# EAGLE design arduino_uno_pcb _with_lcd (EAGLE 6.1)
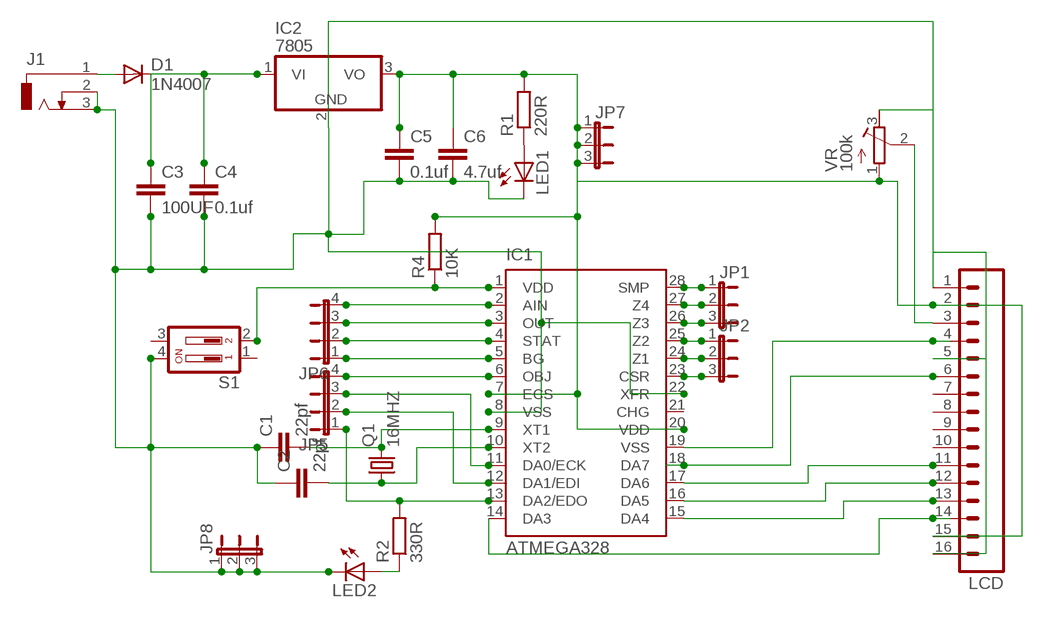
[diagram p0: schematic, sheet 1]

## Parts
C1  22pf  C2.5/2  [C2.5-2]
C2  22pf  C2.5/2  [C2.5-2]
C3  100UF  C2.5/2  [C2.5-2]
C4  0.1uf  C2.5/2  [C2.5-2]
C5  0.1uf  C2.5/2  [C2.5-2]
C6  4.7uf  C2.5/2  [C2.5-2]
D1  1N4007  1N4004  [DO41-10]
IC1  ATMEGA328  QT9701BD  [DIL28-3]
IC2  7805  786TV  [TO220V]
J1  DCJ0303  [DCJ0303]
JP1  JP2E  [JP2]
JP2  JP2E  [JP2]
JP5  JP4E  [JP4]
JP6  JP4E  [JP4]
JP7  JP2E  [JP2]
JP8  JP2E  [JP2]
LCD  M16  [16P]
LED1  LED3MM  [LED3MM]
LED2  LED3MM  [LED3MM]
Q1  16MHZ  CRYSTALHC49S  [HC49/S]
R1  220R  R-EU_0207/10  [0207/10]
R2  330R  R-EU_0207/10  [0207/10]
R4  10K  R-EU_0207/10  [0207/10]
S1  DP02  [DP-02]
VR  100k  R-TRIMM64P  [RTRIM64P]

## Nets
N$1: C1.2 IC1.9(XT1) Q1.2
N$2: C2.2 IC1.10(XT2) Q1.1
N$3: D1.A J1.1
N$4: C5.1 C6.1 IC1.7(ECS) IC1.20(VDD) IC2.3(VO) JP7.1 JP7.2 JP7.3 LCD.2 LCD.15 R1.2 R4.2 VR.1(E)
N$5: C1.1 C2.1 C3.2 C4.2 C5.2 C6.2 IC1.8(VSS) IC1.22(XFR) IC2.2(GND) J1.2 J1.3 JP8.1 JP8.2 JP8.3 LCD.1 LCD.5 LCD.16 LED1.K(C) LED2.K(C) S1.4 VR.3(A)
N$6: LED1.A R1.1
N$7: C3.1 C4.1 D1.C IC2.1(VI)
N$8: IC1.28(SMP) JP1.1
N$9: IC1.27(Z4) JP1.2
N$10: IC1.26(Z3) JP1.3
N$11: IC1.25(Z2) JP2.1
N$12: IC1.24(Z1) JP2.2
N$13: IC1.23(CSR) JP2.3
N$14: IC1.5(BG) JP6.1
N$15: IC1.2(AIN) JP6.4
N$16: IC1.3(OUT) JP6.3
N$17: IC1.4(STAT) JP6.2
N$18: IC1.6(OBJ) JP5.4
N$19: IC1.12(DA1/EDI) JP5.2
N$20: IC1.11(DA0/ECK) JP5.3
N$21: IC1.13(DA2/EDO) JP5.1 R2.2
N$22: LCD.3 VR.2(S)
N$23: IC1.19(VSS) LCD.4
N$24: IC1.18(DA7) LCD.6
N$25: IC1.17(DA6) LCD.11
N$26: IC1.16(DA5) LCD.12
N$27: IC1.15(DA4) LCD.13
N$29: IC1.14(DA3) LCD.14
N$31: IC1.1(VDD) R4.1 S1.2
N$32: LED2.A R2.1
Unconnected: IC1.21(CHG) LCD.7 LCD.8 LCD.9 LCD.10 S1.1 S1.3

## Library data of the parts
C1-C6 = capacitor-wima:C: CAPACITOR naming: grid - package width
D1 = diode:1N4004: DIODE general purpose rectifier, 1 A
IC1 = quantum-research-group:QT9701B: Charge-Transfer Capacitance Sensor IC Source: http://data.qprox.com/downloads/datasheets/qt9701b.pdf; OC_FARNELL: unknown; OC_NEWARK: unknown
IC2 = linear:78*: Positive VOLTAGE REGULATOR Source: http://cache.national.com/ds/LM/LM78L05.pdf http://www.fairchildsemi.com/ds/LM/LM7805.pdf
J1 = con-jack:DCJ0303: DC POWER JACK Source: DCJ0303.pdf; OC_FARNELL: unknown; OC_NEWARK: unknown
JP1 JP2 JP7 JP8 = jumper:JP2E: JUMPER
JP5 JP6 = jumper:JP4E: JUMPER
LCD = con-amp-quick:M16: AMP QUICK CONNECTOR; OC_FARNELL: unknown; OC_NEWARK: unknown
LED1 LED2 = led:LED: LED OSRAM: - CHIPLED LG R971, LG N971, LY N971, LG Q971, LY Q971, LO R971, LY R971 LH N974, LH R974 LS Q976, LO Q976, LY Q976 LO Q996 - Hyper CHIPLED LW Q18S LB Q993, LB Q99A, LB R99A - SideLED LS A670, LO A670, LY A670, LG A670, LP A670 LB A673, LV A673, LT A673, LW A673 LH A674 LY A675 LS A676, LA A676, LO A676, LY A676, LW A676 LS A679, LY A679, LG A679 - Hyper Micro SIDELED® LS Y876, LA Y876, LO Y876, LY Y876 LT Y87S - SmartLED LW L88C, LW L88S LB L89C, LB L89S, LG L890 LS L89K, LO L89K, LY L89K LS L896, LA L896, LO L896, LY L896 - TOPLED LS T670, LO T670, LY T670, LG T670, LP T670 LSG T670, LSP T670, LSY T670, LOP T670, LYG T670 LG T671, LOG T671, LSG T671 LB T673, LV T673, LT T673, LW T673 LH T674 LS T676, LA T676, LO T676, LY T676, LB T676, LH T676, LSB T676, LW T676 LB T67C, LV T67C, LT T67C, LS T67K, LO T67K, LY T67K, LW E67C LS E67B, LA E67B, LO E67B, LY E67B, LB E67C, LV E67C, LT E67C LW T67C LS T679, LY T679, LG T679 LS T770, LO T770, LY T770, LG T770, LP T770 LB T773, LV T773, LT T773, LW T773 LH T774 LS E675, LA E675, LY E675, LS T675 LS T776, LA T776, LO T776, LY T776, LB T776 LHGB T686 LT T68C, LB T68C - Hyper Mini TOPLED® LB M676 - Mini TOPLED Santana® LG M470 LS M47K, LO M47K, LY M47K Source: http://www.osram.convergy.de LUXEON: - LUMILED® LXK2-PW12-R00, LXK2-PW12-S00, LXK2-PW14-U00, LXK2-PW14-V00 LXK2-PM12-R00, LXK2-PM12-S00, LXK2-PM14-U00 LXK2-PE12-Q00, LXK2-PE12-R00, LXK2-PE12-S00, LXK2-PE14-T00, LXK2-PE14-U00 LXK2-PB12-K00, LXK2-PB12-L00, LXK2-PB12-M00, LXK2-PB14-N00, LXK2-PB14-P00, LXK2-PB14-Q00 LXK2-PR12-L00, LXK2-PR12-M00, LXK2-PR14-Q00, LXK2-PR14-R00 LXK2-PD12-Q00, LXK2-PD12-R00, LXK2-PD12-S00 LXK2-PH12-R00, LXK2-PH12-S00 LXK2-PL12-P00, LXK2-PL12-Q00, LXK2-PL12-R00 Source: www.luxeon.com KINGBRIGHT: KA-3528ASYC Source: www.kingbright.com
Q1 = crystal:CRYSTAL: CRYSTAL; OC_FARNELL: 1667008; OC_NEWARK: unknown
R1 R2 R4 = rcl:R-EU_: RESISTOR, European symbol
S1 = switch-dil:DP02: DIL/CODE SWITCH; MPN: MCDP02; OC_FARNELL: 1255233; OC_NEWARK: 26M1095
VR = resistor:R-TRIMM: Trimm resistor

## Board
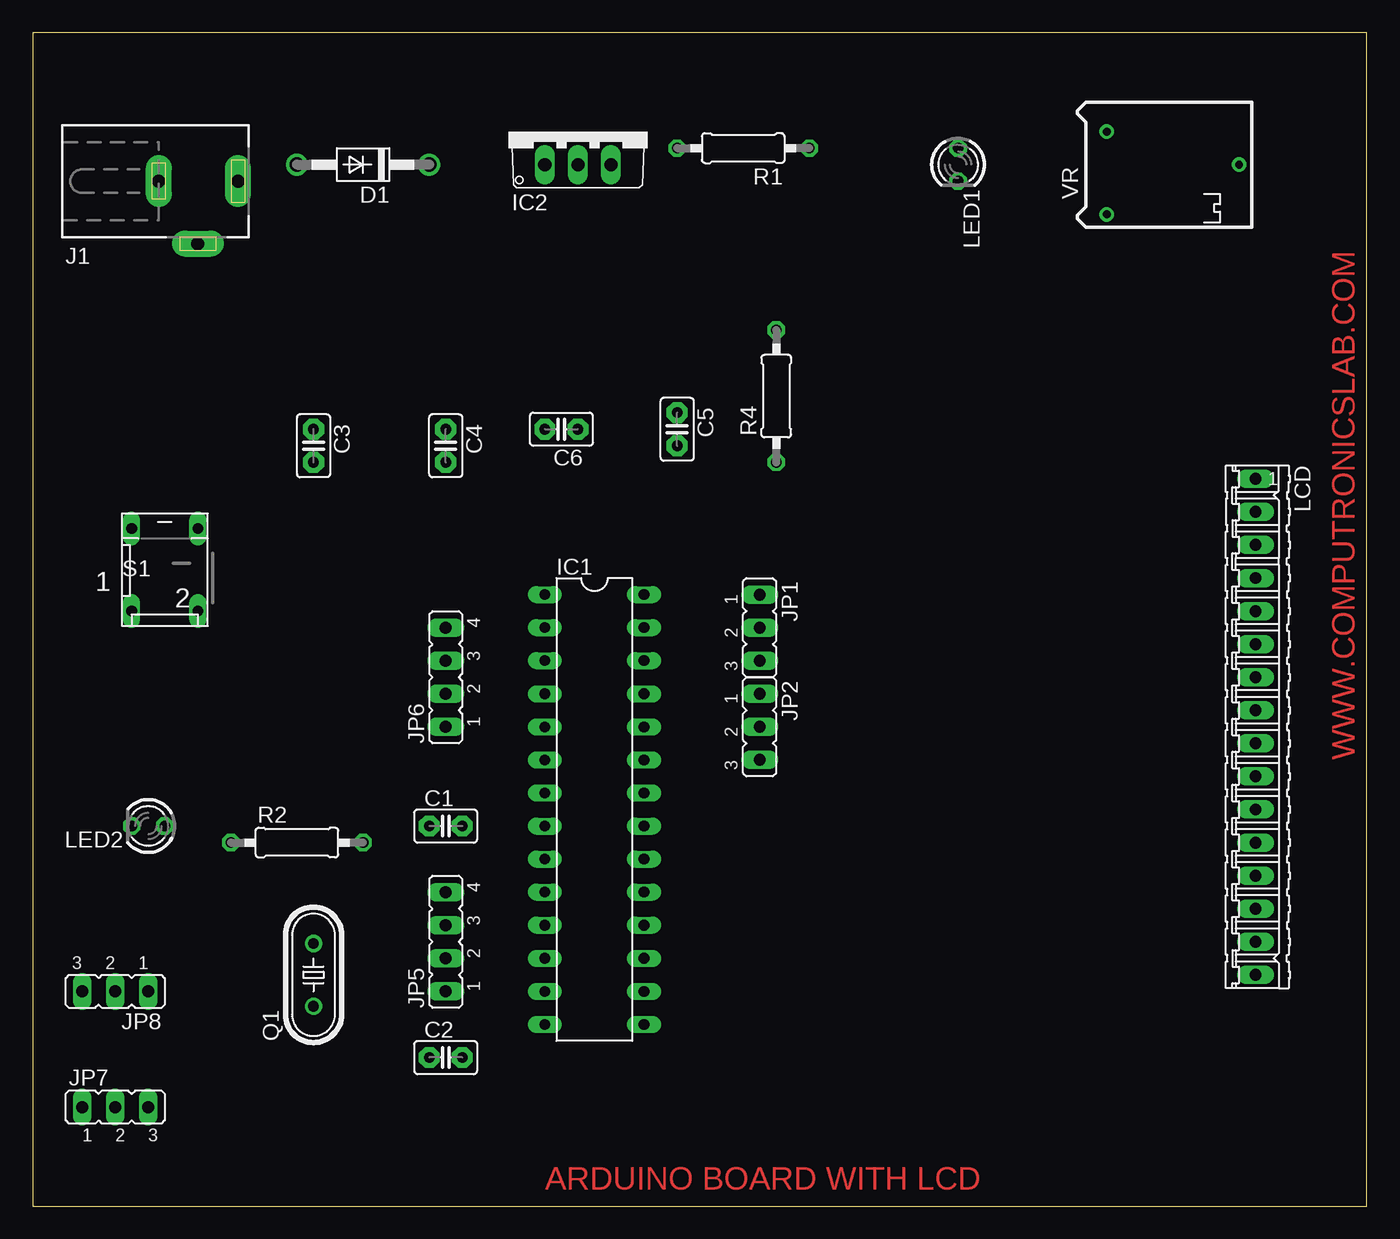
[diagram p1: board, top side]
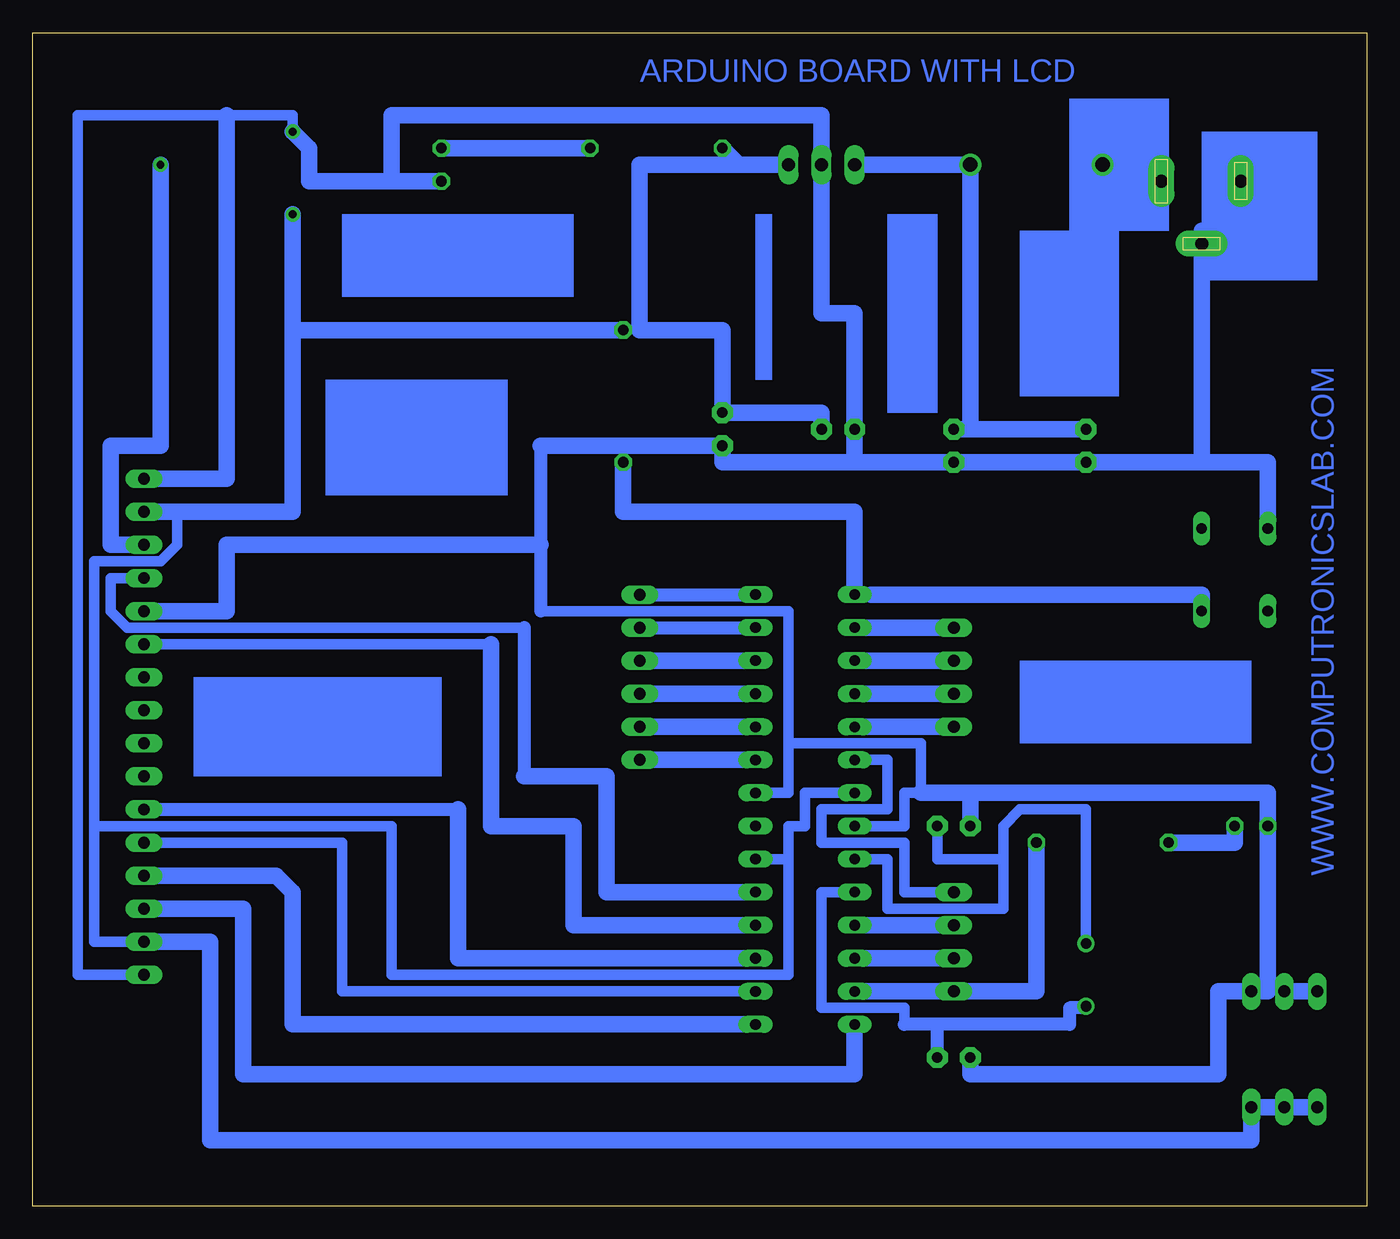
[diagram p2: board, bottom side, seen from below]

Size 102.54 x 90.16 mm. Coordinates in mm from the lower left corner, seen from the top.
Outline: 0,0 102.54,0 102.54,90.16 0,90.16 0,0
Copper layers (1*16): Top 0.035mm / dielectric 1.5mm / Bottom 0.035mm
Design rules: minimum track width 20mil, minimum drill 24mil, track to track 8mil, track to pad 8mil, pad to pad 8mil, via to via 8mil, smd to smd 8mil, copper to edge 40mil, drill to drill 8mil, minimum pad ring 10mil, minimum via ring 8mil, stop-mask expansion 4mil, vias tented up to drill 0mil, thermal gap 10mil

### Footprints (pad centres in the part's own frame; a part is rotated, then mirrored left to right if it is on the bottom)
C2.5-2 = drill 0.813 pad 1.6 octagon: 1 -1.27,0; 2 1.27,0
DO41-10 = drill 1.118: A 5.08,0; C -5.08,0
DIL28-3 = drill 0.813 long: 1 -16.51,-3.81; 2 -13.97,-3.81; 3 -11.43,-3.81; 4 -8.89,-3.81; 5 -6.35,-3.81; 6 -3.81,-3.81; 7 -1.27,-3.81; 8 1.27,-3.81; 9 3.81,-3.81; 10 6.35,-3.81; 11 8.89,-3.81; 12 11.43,-3.81; 13 13.97,-3.81; 14 16.51,-3.81; 15 16.51,3.81; 16 13.97,3.81; 17 11.43,3.81; 18 8.89,3.81; 19 6.35,3.81; 20 3.81,3.81; 21 1.27,3.81; 22 -1.27,3.81; 23 -3.81,3.81; 24 -6.35,3.81; 25 -8.89,3.81; 26 -11.43,3.81; 27 -13.97,3.81; 28 -16.51,3.81
TO220V = drill 1.016 long: 1 -2.54,-2.54; 2 0,-2.54; 3 2.54,-2.54
DCJ0303 = drill 1 pad 2 long: 1 0,3.1; 2 4.8,0; 3 0,-3
JP2 = drill 0.914 long: 1 -2.54,0; 2 0,0; 3 2.54,0
JP4 = drill 0.914 long: 1 -3.81,0; 2 -1.27,0; 3 1.27,0; 4 3.81,0
16P = drill 0.914 long: 1 -19.05,0; 2 -16.51,0; 3 -13.97,0; 4 -11.43,0; 5 -8.89,0; 6 -6.35,0; 7 -3.81,0; 8 -1.27,0; 9 1.27,0; 10 3.81,0; 11 6.35,0; 12 8.89,0; 13 11.43,0; 14 13.97,0; 15 16.51,0; 16 19.05,0
LED3MM = drill 0.813 octagon: A -1.27,0; K 1.27,0
HC49/S = drill 0.813: 1 -2.413,0; 2 2.413,0
0207/10 = drill 0.813 octagon: 1 -5.08,0; 2 5.08,0
DP-02 = drill 0.813 long: 1 -2.54,-2.54; 2 2.54,-2.54; 3 2.54,3.81; 4 -2.54,3.81
RTRIM64P = drill 0.61: 1 -2.54,-3.81; 2 7.62,0; 3 -2.54,2.54

### Placement (x,y rotation side)
C1  31.75,29.21 0 top
C2  31.75,11.43 0 top
C3  21.59,58.42 270 top
C4  31.75,58.42 270 top
C5  49.53,59.69 270 top
C6  40.64,59.69 180 top
D1  25.4,80.01 180 top
IC1  43.18,30.48 270 top
IC2  41.91,82.55 0 top
J1  12.7,78.74 270 top
JP1  55.88,44.45 270 top
JP2  55.88,36.83 270 top
JP5  31.75,20.32 90 top
JP6  31.75,40.64 90 top
JP7  6.35,7.62 0 top
JP8  6.35,16.51 180 top
LCD  93.98,36.83 270 top
LED1  71.12,80.01 270 top
LED2  8.89,29.21 180 top
Q1  21.59,17.78 90 top
R1  54.61,81.28 180 top
R2  20.32,27.94 0 top
R4  57.15,62.23 90 top
S1  10.16,48.26 0 top
VR  85.09,80.01 0 top

### Tracks (layer width: path | path; a pad name or v marks a point on that pad's centre or on a via)
N$1
  Bottom 0.813: Q1.2 21.59,30.48 26.67,30.48 27.94,29.21 27.94,26.67 | C1.2 33.02,26.67 29.21,26.67 27.94,26.67 | IC1.9 36.83,26.67 36.83,22.86 35.56,22.86 27.94,22.86 27.94,26.67
N$2
  Bottom 0.508: 21.59,15.24 Q1.1
  Bottom 0.813: IC1.10 41.91,24.13 41.91,15.24 35.56,15.24 35.56,13.97
  Bottom 1.016: C2.2 33.02,13.97 | 21.59,15.24 22.86,15.24 22.86,13.97 33.02,13.97 | 33.02,13.97 35.56,13.97
N$3
  Bottom 1.27: D1.A 20.32,78.74 J1.1
N$4
  Bottom 0.508: 82.55,67.31 VR.1 | R4.2 55.88,67.31
  Bottom 0.813: 44.45,26.67 44.45,29.21 43.18,29.21 43.18,31.75 IC1.7 | LCD.15 97.79,20.32 97.79,29.21 | 97.79,29.21 97.79,49.53 92.71,49.53 91.44,50.8 91.44,53.34 | 44.45,26.67 IC1.20 | 44.45,26.67 44.45,17.78 74.93,17.78 74.93,29.21 97.79,29.21
  Bottom 1.27: C6.1 41.91,60.96 C5.1 49.53,67.31 55.88,67.31 55.88,80.01 48.26,80.01 | 48.26,80.01 R1.2 | IC2.3 48.26,80.01 | R4.2 82.55,67.31 | JP7.1 JP7.2 JP7.3 8.89,5.08 88.9,5.08 88.9,20.32 LCD.15 | LCD.2 91.44,53.34 82.55,53.34 VR.1
N$5
  Bottom 0.508: JP8.2 7.62,16.51
  Bottom 0.813: LCD.16 99.06,17.78 99.06,83.82 87.63,83.82 82.55,83.82 VR.3 | IC1.8 35.56,29.21 35.56,31.75 34.29,31.75 34.29,35.56 44.45,35.56 | IC1.22 44.45,31.75 44.45,35.56 | 44.45,35.56 44.45,45.72 63.5,45.72
  Bottom 1.016: 63.5,58.42 63.5,45.72
  Bottom 1.27: LED1.K 74.93,78.74 | 74.93,78.74 81.28,78.74 81.28,81.28 VR.3 | LCD.1 87.63,55.88 87.63,83.82 | 30.48,31.75 34.29,31.75 | JP8.2 JP8.3 | C2.1 30.48,10.16 11.43,10.16 11.43,16.51 JP8.1 7.62,16.51 LED2.K 7.62,31.75 30.48,31.75 | 30.48,31.75 C1.1 | LCD.5 87.63,45.72 87.63,50.8 63.5,50.8 | 63.5,58.42 C5.2 49.53,57.15 39.37,57.15 | 39.37,57.15 C6.2 39.37,68.58 41.91,68.58 IC2.2 41.91,83.82 74.93,83.82 74.93,78.74 | 39.37,57.15 C4.2 C3.2 12.7,57.15 | J1.3 8.89,78.74 8.89,74.93 12.7,74.93 J1.2 12.7,57.15 | 12.7,57.15 7.62,57.15 S1.4
N$6
  Bottom 1.27: LED1.A R1.1
N$7
  Bottom 1.27: IC2.1 D1.C 30.48,59.69 | C4.1 30.48,59.69 | 30.48,59.69 C3.1
N$8
  Bottom 1.016: JP1.1 IC1.28
N$9
  Bottom 1.016: JP1.2 IC1.27
N$10
  Bottom 1.27: JP1.3 IC1.26
N$11
  Bottom 1.27: JP2.1 IC1.25
N$12
  Bottom 1.27: JP2.2 IC1.24
N$13
  Bottom 1.27: JP2.3 IC1.23
N$14
  Bottom 1.27: JP6.1 IC1.5
N$15
  Bottom 1.27: JP6.4 IC1.2
N$16
  Bottom 1.27: JP6.3 IC1.3
N$17
  Bottom 1.27: JP6.2 IC1.4
N$18
  Bottom 0.813: IC1.6 36.83,34.29 36.83,30.48 40.64,30.48 41.91,30.48 41.91,29.21 41.91,27.94 35.56,27.94 35.56,24.13 JP5.4
N$19
  Bottom 1.27: JP5.2 IC1.12
N$20
  Bottom 1.27: JP5.3 IC1.11
N$21
  Bottom 1.27: R2.2 25.4,16.51 JP5.1 IC1.13
N$22
  Bottom 1.27: VR.2 92.71,58.42 96.52,58.42 96.52,50.8 LCD.3
N$23
  Bottom 0.813: 64.77,44.45 95.25,44.45 96.52,45.72 96.52,48.26 LCD.4
  Bottom 1.016: 64.77,44.45 64.77,33.02
  Bottom 1.27: IC1.19 58.42,24.13 58.42,33.02 64.77,33.02
N$24
  Bottom 0.813: 67.31,43.18 74.93,43.18 LCD.6
  Bottom 1.27: IC1.18 60.96,21.59 60.96,29.21 67.31,29.21 67.31,43.18
N$25
  Bottom 1.016: LCD.11 69.85,30.48
  Bottom 1.27: IC1.17 69.85,19.05 69.85,27.94 69.85,30.48
N$26
  Bottom 0.813: IC1.16 78.74,16.51 78.74,20.32 78.74,27.94 LCD.12
N$27
  Bottom 1.27: IC1.15 82.55,13.97 82.55,24.13 83.82,25.4 LCD.13
N$29
  Bottom 0.508: 86.36,12.7 86.36,13.97
  Bottom 1.27: IC1.14 39.37,10.16 82.55,10.16 86.36,10.16 86.36,13.97 | LCD.14 86.36,22.86 86.36,12.7
N$31
  Bottom 0.813: IC1.1 38.1,46.99
  Bottom 1.27: S1.2 12.7,46.99 38.1,46.99 | IC1.1 39.37,53.34 57.15,53.34 R4.1
N$32
  Bottom 1.27: R2.1 10.16,27.94 LED2.A
(copper drawn outside any net)
  shapes: Bottom area x9

### Text on the board
Top: WWW.COMPUTRONICSLAB.COM | ARDUINO BOARD WITH LCD
Bottom: ARDUINO BOARD WITH LCD | WWW.COMPUTRONICSLAB.COM